# EAGLE design GameSch (EAGLE 9.3.2)
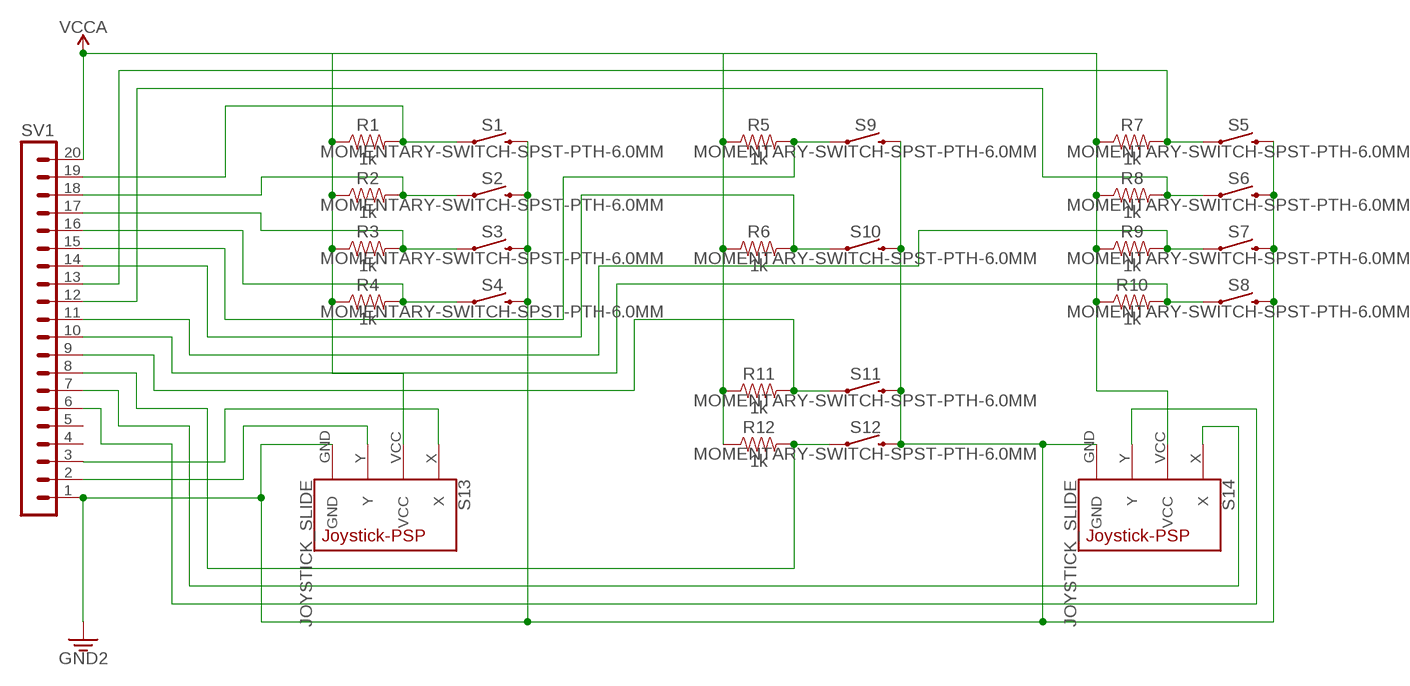
[diagram p0: schematic, sheet 1]

## Parts
R1  1k  1KOHM-HORIZ-1/4W-5%  [AXIAL-0.3]
R2  1k  1KOHM-HORIZ-1/4W-5%  [AXIAL-0.3]
R3  1k  1KOHM-HORIZ-1/4W-5%  [AXIAL-0.3]
R4  1k  1KOHM-HORIZ-1/4W-5%  [AXIAL-0.3]
R5  1k  1KOHM-HORIZ-1/4W-5%  [AXIAL-0.3]
R6  1k  1KOHM-HORIZ-1/4W-5%  [AXIAL-0.3]
R7  1k  1KOHM-HORIZ-1/4W-5%  [AXIAL-0.3]
R8  1k  1KOHM-HORIZ-1/4W-5%  [AXIAL-0.3]
R9  1k  1KOHM-HORIZ-1/4W-5%  [AXIAL-0.3]
R10  1k  1KOHM-HORIZ-1/4W-5%  [AXIAL-0.3]
R11  1k  1KOHM-HORIZ-1/4W-5%  [AXIAL-0.3]
R12  1k  1KOHM-HORIZ-1/4W-5%  [AXIAL-0.3]
S1  MOMENTARY-SWITCH-SPST-PTH-6.0MM  [TACTILE_SWITCH_PTH_6.0MM]
S2  MOMENTARY-SWITCH-SPST-PTH-6.0MM  [TACTILE_SWITCH_PTH_6.0MM]
S3  MOMENTARY-SWITCH-SPST-PTH-6.0MM  [TACTILE_SWITCH_PTH_6.0MM]
S4  MOMENTARY-SWITCH-SPST-PTH-6.0MM  [TACTILE_SWITCH_PTH_6.0MM]
S5  MOMENTARY-SWITCH-SPST-PTH-6.0MM  [TACTILE_SWITCH_PTH_6.0MM]
S6  MOMENTARY-SWITCH-SPST-PTH-6.0MM  [TACTILE_SWITCH_PTH_6.0MM]
S7  MOMENTARY-SWITCH-SPST-PTH-6.0MM  [TACTILE_SWITCH_PTH_6.0MM]
S8  MOMENTARY-SWITCH-SPST-PTH-6.0MM  [TACTILE_SWITCH_PTH_6.0MM]
S9  MOMENTARY-SWITCH-SPST-PTH-6.0MM  [TACTILE_SWITCH_PTH_6.0MM]
S10  MOMENTARY-SWITCH-SPST-PTH-6.0MM  [TACTILE_SWITCH_PTH_6.0MM]
S11  MOMENTARY-SWITCH-SPST-PTH-6.0MM  [TACTILE_SWITCH_PTH_6.0MM]
S12  MOMENTARY-SWITCH-SPST-PTH-6.0MM  [TACTILE_SWITCH_PTH_6.0MM]
S13  JOYSTICK_SLIDE  [JOYSTICK-PSP1000]
S14  JOYSTICK_SLIDE  [JOYSTICK-PSP1000]
SV1  MA20-1  [MA20-1]

## Nets
3.3V: S1.3 S2.3 S3.3 S4.3 S5.3 S6.3 S7.3 S8.3 S9.3 S10.3 S11.3 S12.3 S13.GND S14.GND SV1.1 ; supply symbol labelled GND2
N$1: R1.P$2 S1.1 SV1.19
N$2: R2.P$2 S2.1 SV1.18
N$3: R3.P$2 S3.1 SV1.17
N$4: R4.P$2 S4.1 SV1.16
N$5: R5.P$2 S9.1 SV1.15
N$6: R6.P$2 S10.1 SV1.14
N$7: R11.P$2 S11.1 SV1.9
N$8: R12.P$2 S12.1 SV1.8
N$9: R7.P$2 S5.1 SV1.13
N$10: R8.P$2 S6.1 SV1.12
N$11: R9.P$2 S7.1 SV1.11
N$12: R10.P$2 S8.1 SV1.10
N$13: S14.X SV1.7
N$14: S14.Y SV1.6
N$15: S13.Y SV1.2
N$16: S13.X SV1.3
VCCA: R1.P$1 R2.P$1 R3.P$1 R4.P$1 R5.P$1 R6.P$1 R7.P$1 R8.P$1 R9.P$1 R10.P$1 R11.P$1 R12.P$1 S13.VCC S14.VCC SV1.20
Unconnected: SV1.4 SV1.5

## Library data of the parts
R1-R12 = SparkFun-Resistors:1KOHM: 1kΩ resistor A resistor is a passive two-terminal electrical component that implements electrical resistance as a circuit element. Resistors act to reduce current flow, and, at the same time, act to lower voltage levels within circuits. - Wikipedia; PROD_ID: RES-08380
S1-S12 = SparkFun-Switches:MOMENTARY-SWITCH-SPST: Momentary Switch (Pushbutton) - SPST Normally-open (NO) SPST momentary switches (buttons, pushbuttons). Variants PTH-12MM - 12mm square, through-hole Momentary Pushbutton Switch - 12mm Square <https://www.sparkfun.com/products/9190> (COM-09190) PTH-6.0MM, PTH-6.0MM-KIT - 6.0mm square, through-hole Mini Pushbutton Switch <https://www.sparkfun.com/products/97> (COM-00097) KIT package intended for soldering kit's - only one side of pads' copper is exposed. PTH-RIGHT-ANGLE-KIT - Right-angle, through-hole Right Angle Tactile Button <https://www.sparkfun.com/products/10791> - Used on SparkFun BigTime Watch Kit <https://www.sparkfun.com/products/11734> SMD-12MM - 12mm square, surface-mount Tactile Button - SMD (12mm) <https://www.sparkfun.com/products/12993> (COM-12993) Used on SparkFun PicoBoard <https://www.sparkfun.com/products/11888> SMD-4.5MM - 4.5mm Square Trackball Switch Used on SparkFun Blackberry Trackballer Breakout <https://www.sparkfun.com/products/13169> SMD-4.6MMX2.8MM - 4.60mm x 2.80mm, surface mount Used on SparkFun SAMD21 Mini Breakout <https://www.sparkfun.com/products/13664> SMD-5.2MM, SMD-5.2-REDUNDANT - 5.2mm square, surface-mount Mini Pushbutton Switch - SMD <https://www.sparkfun.com/products/8720> (COM-08720) Used on Arduino Pro Mini <https://www.sparkfun.com/products/11114> REDUNDANT package connects both switch circuits together SMD-6.0X3.5MM - 6.0 x 3.5mm, surface mount Momentary Reset Switch SMD <https://www.sparkfun.com/products/8229> (COM-08229) SMD-6.2MM-TALL - 6.2mm square, surface mount Tactile Button - SMD (6mm) <https://www.sparkfun.com/products/12992> Used on SparkFun Digital Sandbox <https://www.sparkfun.com/products/12651> SMD-RIGHT-ANGLE - Right-angle, surface mount Used on SparkFun Block for Intel® Edison - Arduino <https://www.sparkfun.com/products/13036>; PROD_ID: SWCH-08441; SF_SKU: COM-00097
S13 S14 = SparkFun-Switches:JOYSTICK_SLIDE: Resistive Thumb Slide Joystick This is a resistive analog joystick, very similar to those found on the PSP1000. These compact joysticks are different in that they have a very interesting ‘slide’ feeling. SparkFun Products Thumb Slide Joystick <https://www.sparkfun.com/products/9426> (COM-09426); SF_SKU: COM-09426
SV1 = con-lstb:MA20-1: PIN HEADER; OC_FARNELL: unknown; OC_NEWARK: unknown

## Board
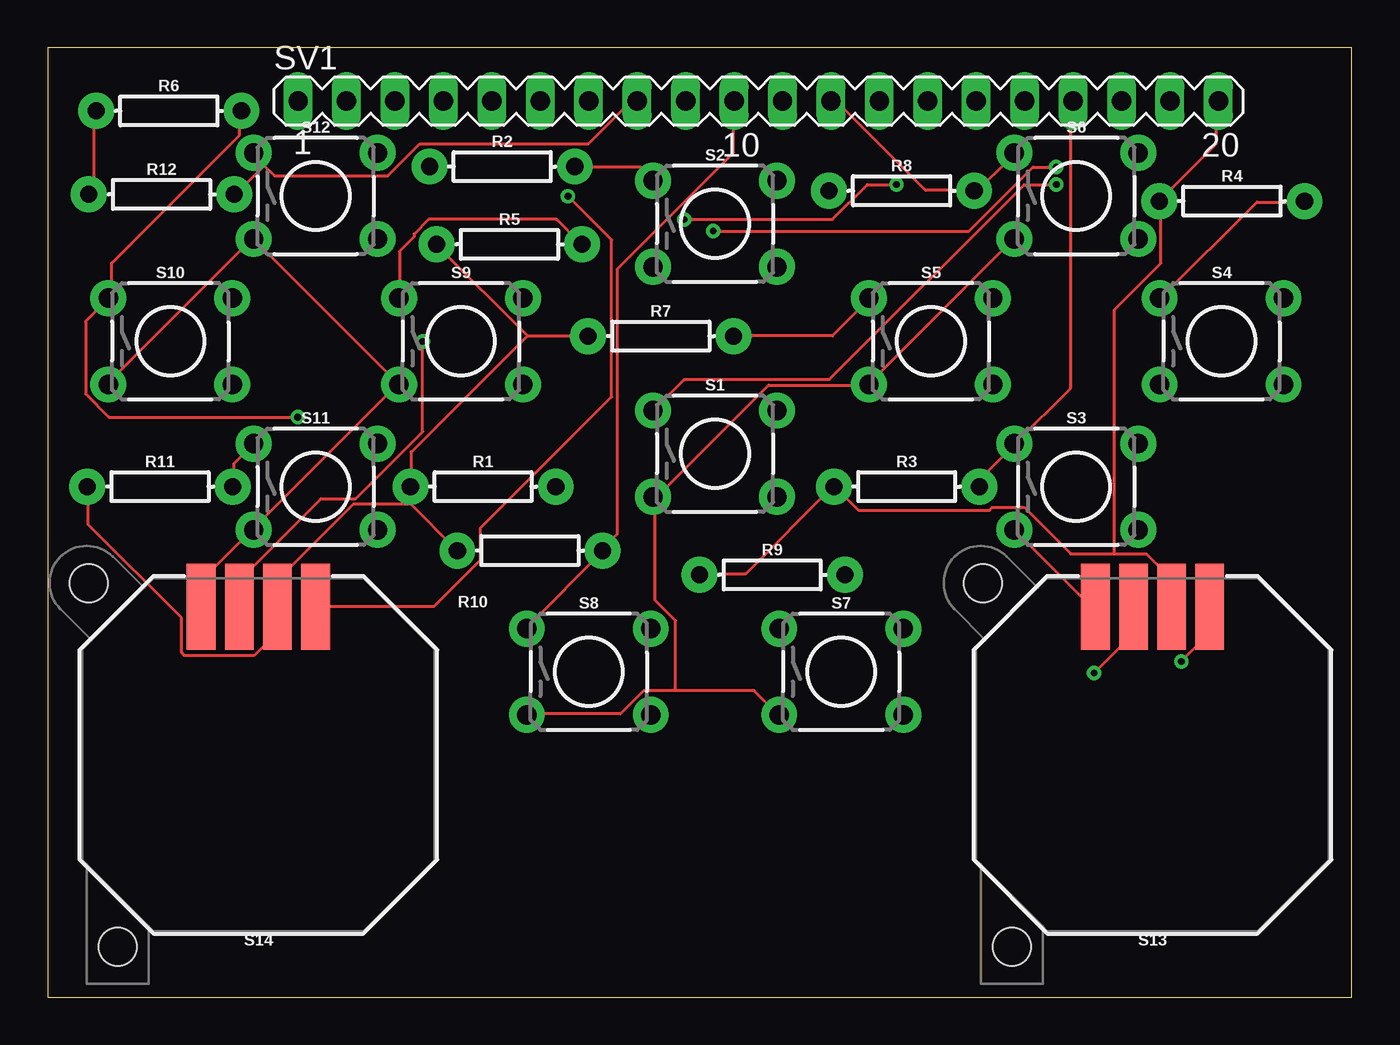
[diagram p1: board, top side]
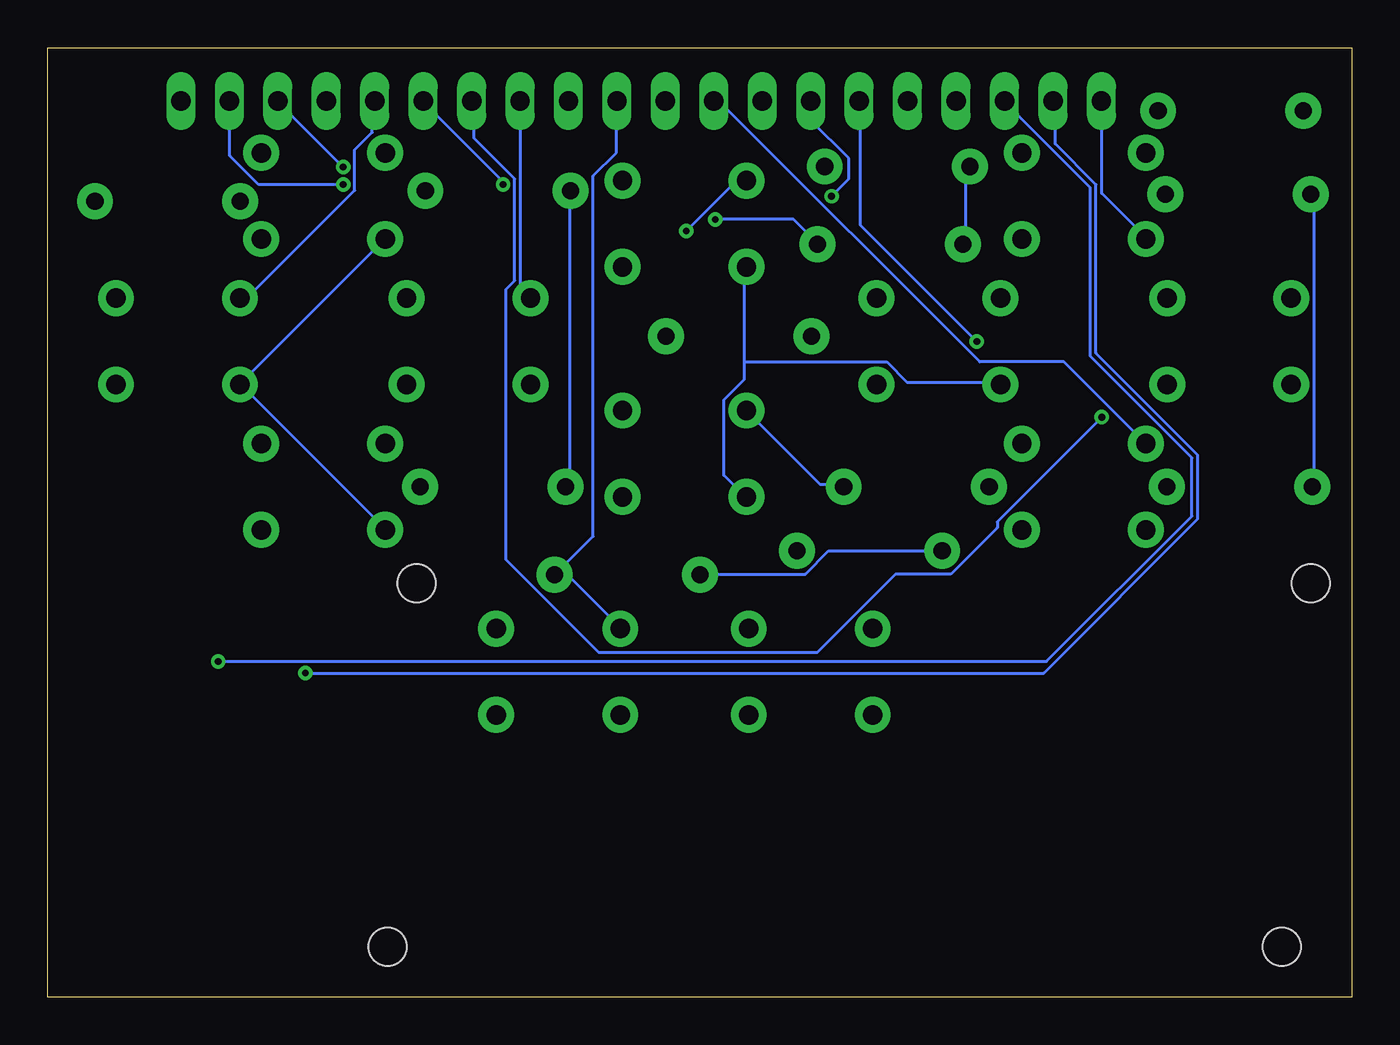
[diagram p2: board, bottom side, seen from below]

Size 68.38 x 49.76 mm. Coordinates in mm from the lower left corner, seen from the top.
Outline: 0,0 68.38,0 68.38,49.76 0,49.76 0,0
Copper layers (1*16): Top 0.035mm / dielectric 1.5mm / Bottom 0.035mm
Design rules "default": minimum track width 6mil, minimum drill 0.35mm, track to track 6mil, track to pad 6mil, pad to pad 6mil, via to via 6mil, smd to smd 6mil, copper to edge 40mil, drill to drill 6mil, minimum pad ring 10mil, minimum via ring 8mil, stop-mask expansion 4mil, vias tented up to drill 0mil, thermal gap 10mil

### Footprints (pad centres in the part's own frame; a part is rotated, then mirrored left to right if it is on the bottom)
AXIAL-0.3 = drill 0.9 pad 1.88: P$1 -3.81,0; P$2 3.81,0
TACTILE_SWITCH_PTH_6.0MM = drill 1.016 pad 1.88: 1 -3.251,2.261; 2 3.251,2.261; 3 -3.251,-2.261; 4 3.251,-2.261
JOYSTICK-PSP1000 = smd 1.5 x 4.5: GND -3,7.75; VCC 1,7.75; X 3,7.75; Y -1,7.75 | hole 2: -8.89,8.985; -7.375,-10.06
MA20-1 = drill 1.016 long: 1 -24.13,0; 2 -21.59,0; 3 -19.05,0; 4 -16.51,0; 5 -13.97,0; 6 -11.43,0; 7 -8.89,0; 8 -6.35,0; 9 -3.81,0; 10 -1.27,0; 11 1.27,0; 12 3.81,0; 13 6.35,0; 14 8.89,0; 15 11.43,0; 16 13.97,0; 17 16.51,0; 18 19.05,0; 19 21.59,0; 20 24.13,0

### Placement (x,y rotation side)
R1  22.83,26.75 0 top
R2  23.83,43.53 0 top
R3  45.04,26.75 0 top
R4  62.09,41.72 0 top
R5  24.21,39.45 0 top
R6  6.35,46.45 0 top
R7  32.15,34.64 0 top
R8  44.77,42.26 0 top
R9  37.99,22.13 0 top
R10  25.29,23.4 0 top
R11  5.89,26.75 0 top
R12  5.97,42.07 0 top
S1  34.99,28.48 0 top
S2  34.99,40.53 0 top
S3  53.93,26.75 0 top
S4  61.55,34.37 0 top
S5  46.31,34.37 0 top
S6  53.93,41.99 0 top
S7  41.61,17.05 0 top
S8  28.37,17.05 0 top
S9  21.67,34.37 0 top
S10  6.43,34.37 0 top
S11  14.05,26.75 0 top
S12  14.05,41.99 0 top
S13  57.93,12.7 0 top
S14  11.05,12.7 0 top
SV1  37.26,46.96 0 top

### Tracks (layer width: path | path; a pad name or v marks a point on that pad's centre or on a via)
3.3V
  Top 0.152: S1.3 32.08,26.22 | S14.GND 8.08,20.49 8.08,21.86 10.67,24.45 S11.3 10.82,24.6 18.29,32.07 S9.3 18.29,32.22 10.82,39.69 S12.3 10.67,39.69 3.2,32.22 S10.3 | S6.3 50.6,39.69 43.13,32.22 S5.3 42.98,32.07 37.8,32.07 32.01,26.28 S1.3 | S3.3 50.75,24.45 54.87,20.33 S13.GND | 32.92,16.07 37.04,16.07 38.26,14.85 S7.3 | 32.92,16.07 31.25,16.07 30.03,14.85 25.15,14.85 S8.3 | 32.92,16.07 32.92,19.72 31.85,20.79 31.85,26.12 S1.3
  Bottom 0.152: SV1.1 13.11,46.85 13.11,42.13 10.82,39.84 S12.3 | S3.3 50.75,24.6 58.22,32.07 S4.3 58.22,32.22 50.75,39.69 S6.3 | 31.85,33.29 31.85,32.37 32.92,31.31 32.92,27.34 31.85,26.28 S1.3 | 31.85,33.29 31.85,38.16 S2.3 | 31.85,33.29 24.39,33.29 23.32,32.22 18.44,32.22 S9.3
N$1  (via drill 0.35)
  Top 0.152: v52.89,42.58 51.21,42.58 41,32.37 33.38,32.37 31.85,30.85 S1.1
  Bottom 0.152: v52.89,42.58 57.3,42.58 58.83,44.11 58.83,46.85 SV1.19 | R1.P$2 26.67,26.89 27.89,26.89 31.7,30.7 S1.1
N$2  (via drill 0.35)
  Top 0.152: v52.89,43.5 51.67,43.5 48.31,40.15 v34.9,40.15 | R2.P$2 27.74,43.5 31.09,43.5 31.7,42.89 S2.1
  Bottom 0.152: v52.89,43.5 56.24,46.85 SV1.18 | v34.9,40.15 32.31,42.74 31.85,42.74 S2.1
N$3
  Top 0.152: SV1.17 53.65,46.85 53.65,31.92 50.75,29.02 S3.1 50.6,28.87 48.92,27.19 48.92,26.89 R3.P$2
N$4
  Top 0.152: R4.P$2 65.84,41.67 63.4,41.67 58.37,36.64 S4.1
  Bottom 0.152: SV1.16 51.36,46.85 51.36,45.33 52.28,44.41 52.28,42.28 57.91,36.64 58.22,36.64 S4.1
N$5  (via drill 0.35)
  Top 0.152: v44.5,42.58 42.98,42.58 41.15,40.76 v33.38,40.76 | S9.1 18.44,36.64 18.44,39.08 19.21,39.84 19.21,39.99 19.97,40.76 26.67,40.76 27.89,39.54 R5.P$2
  Bottom 0.152: v44.5,42.58 44.5,42.74 48.62,46.85 SV1.15 | v33.38,40.76 29.26,40.76 28.04,39.54 R5.P$2
N$6  (via drill 0.35)
  Top 0.152: 3.28,37.52 3.28,36.76 S10.1 | v13.11,30.39 3.2,30.39 1.98,31.61 1.98,35.42 3.05,36.49 S10.1 | R6.P$2 10.06,46.39 10.06,45.17 3.36,38.47 3.36,37.4 S10.1
  Bottom 0.152: v13.11,30.39 18.6,24.91 18.6,24.6 21.03,22.16 23.93,22.16 28.04,18.05 39.47,18.05 44.35,22.93 44.35,37.1 43.89,37.55 43.89,42.89 46.03,45.02 46.03,46.85 SV1.14
N$7
  Top 0.152: R11.P$2 9.76,26.89 9.76,27.95 10.67,28.87 S11.1
  Bottom 0.152: SV1.9 33.38,46.85 33.07,46.85 19.51,33.29 15.09,33.29 10.82,29.02 S11.1
N$8
  Top 0.152: 11.28,43.65 10.82,44.11 S12.1 11.28,43.65 | 11.28,43.65 11.89,43.04 17.83,43.04 19.51,44.72 28.35,44.72 30.48,46.85 30.79,46.85 SV1.8 | 11.28,43.65 11.28,43.5 9.91,42.13 R12.P$2
N$9
  Top 0.152: 43.06,36.6 S5.1 42.98,36.49 41.15,34.66 35.97,34.66 R7.P$2
  Bottom 0.152: SV1.13 43.59,46.85 43.59,37.1 43.13,36.64 S5.1
N$10
  Top 0.152: SV1.12 41.15,46.85 41.46,46.85 46.03,42.28 48.47,42.28 R8.P$2 48.62,42.13 50.6,44.11 S6.1
N$11
  Bottom 0.152: 41.46,22.47 41.76,22.16 R9.P$2 41.46,22.47 | 41.46,22.47 39.78,24.14 39.78,43.04 38.56,44.26 38.56,46.85 SV1.11 | 41.46,22.47 38.41,19.42 S7.1
N$12
  Top 0.152: SV1.10 35.97,46.85 35.97,44.26 29.87,38.16 29.87,24.3 29.11,23.53 R10.P$2 29.11,23.38 25.15,19.42 S8.1
N$13  (via drill 0.35)
  Top 0.152: v27.28,41.98 29.57,39.69 29.57,31.46 22.71,24.6 22.71,22.93 20.27,20.49 14.18,20.49 S14.X
  Bottom 0.152: v27.28,41.98 26.37,42.89 26.37,43.96 28.35,45.94 28.35,46.85 SV1.7
N$14  (via drill 0.35)
  Top 0.152: v19.66,34.35 19.66,29.63 16.16,26.12 14.33,26.12 10.06,21.86 10.06,20.49 S14.Y
  Bottom 0.152: v19.66,34.35 25.76,40.45 25.76,46.85 SV1.6
N$15  (via drill 0.35)
  Top 0.152: 56.93,21.56 S13.Y 56.85,20.33 56.85,18.96 v54.87,16.98
  Bottom 0.152: v54.87,16.98 16.16,16.98 8.08,25.06 8.08,28.41 13.41,33.74 13.41,42.58 15.55,44.72 15.55,46.85 SV1.2
N$16  (via drill 0.35)
  Top 0.152: 60.93,21.45 S13.X 60.81,20.33 60.81,18.96 v59.44,17.59
  Bottom 0.152: v59.44,17.59 16,17.59 8.38,25.21 8.38,28.26 13.72,33.59 13.72,42.43 18.14,46.85 SV1.3
VCCA
  Top 0.152: 12.05,21.56 S14.VCC | 41.23,26.7 R3.P$1 | R6.P$1 2.44,46.39 2.44,42.28 2.29,42.13 R12.P$1 | 19.05,25.82 19.05,26.74 R1.P$1 | 19.05,25.82 21.34,23.53 R10.P$1 | 19.05,25.82 16,25.82 12.04,21.86 12.04,21.55 S14.VCC | 19.05,25.82 R1.P$1 | 25.15,34.66 28.2,34.66 R7.P$1 | 25.15,34.66 20.42,39.38 R5.P$1 | 25.15,34.66 19.05,28.56 19.05,26.89 R1.P$1 | R11.P$1 2.14,26.74 2.14,24.75 7.01,19.88 7.01,18.05 7.17,17.9 10.82,17.9 12.04,19.12 12.04,20.33 S14.VCC | SV1.20 61.27,46.85 61.27,44.72 58.37,41.82 R4.P$1 58.37,41.67 58.37,38.47 55.93,36.03 55.93,23.23 | R9.P$1 34.29,22.16 36.58,22.16 41.15,26.74 R3.P$1 | 55.93,23.23 53.65,23.23 51.21,25.67 49.53,25.67 49.38,25.52 42.52,25.52 41.3,26.74 R3.P$1 | 55.93,23.23 57.61,23.23 58.83,22.01 58.83,20.49 S13.VCC
  Bottom 0.152: R11.P$1 1.98,26.89 1.98,41.82 2.14,41.98 R12.P$1 | R5.P$1 20.27,39.54 20.27,43.35 20.12,43.5 R2.P$1 | R8.P$1 41,42.13 41,27.04 41.15,26.89 R3.P$1 | R10.P$1 21.49,23.38 27.44,23.38 28.65,22.16 34.14,22.16 R9.P$1